# EAGLE board uOsc_2 board_2_v2.0 (EAGLE 9.2.1)
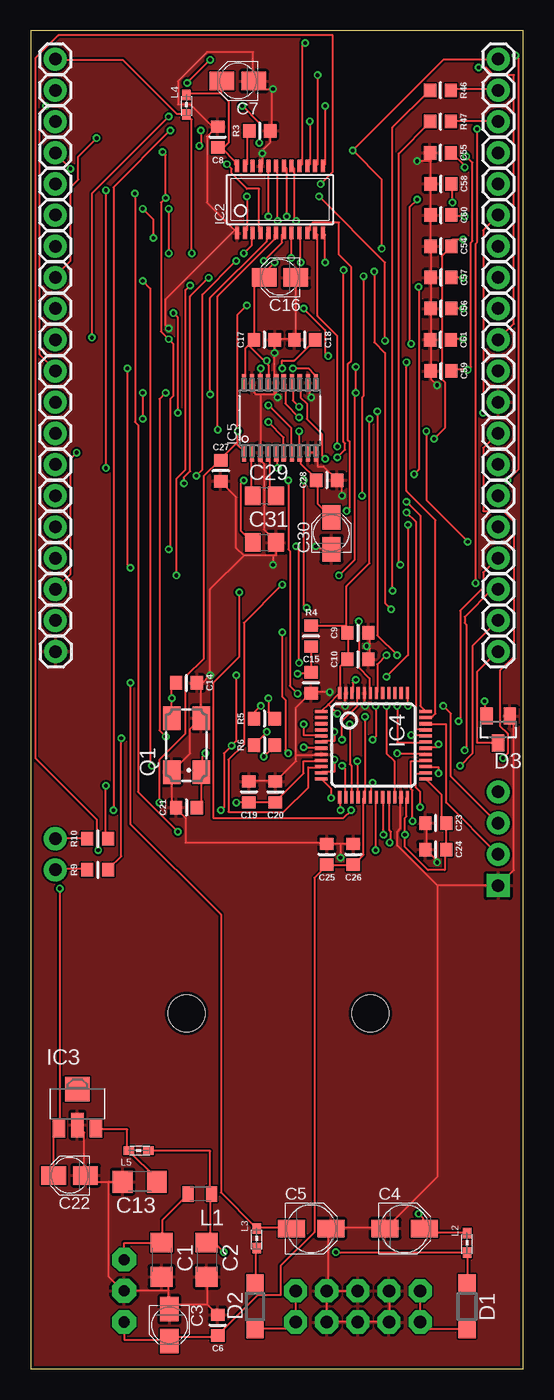
[diagram p5: board, top side]
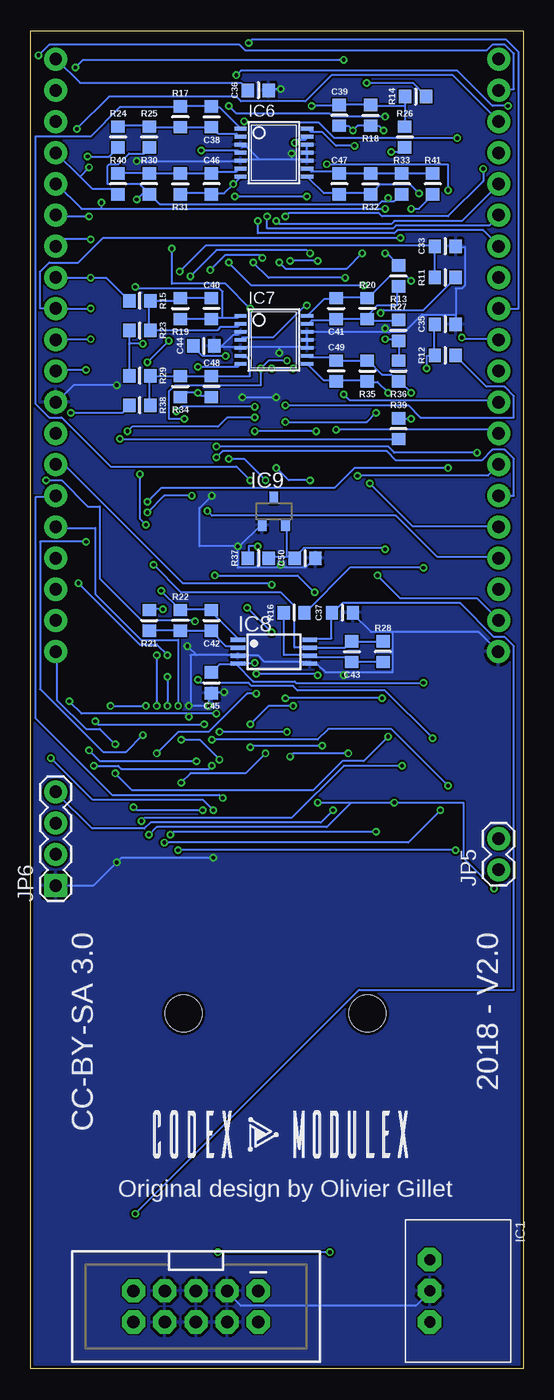
[diagram p6: board, bottom side, seen from below]

Size 40.14 x 109 mm. Coordinates in mm from the lower left corner, seen from the top.
Outline: 0,0 40.14,0 40.14,109 0,109 0,0
Copper layers (1*16): Top 0.035mm / dielectric 1.5mm / Bottom 0.035mm
Design rules "dirt_cheap_dirty_boards.v1.1": minimum track width 6mil, minimum drill 12mil, track to track 6mil, track to pad 6mil, pad to pad 6mil, via to via 6mil, smd to smd 0mil, copper to edge 10mil, drill to drill 10mil, minimum pad ring 10mil, minimum via ring 6mil, stop-mask expansion 2mil, vias tented up to drill 25mil, thermal gap 10mil
Holes 3 mm at 12.7,28.96 27.69,28.96

## Footprints (pad centres in the part's own frame; a part is rotated, then mirrored left to right if it is on the bottom)
PARTS_AMAN_1X01 = drill 1.016 pad 1.88: 1 0,0
C1206 = smd 1.6 x 1.8: 1 -1.4,0; 2 1.4,0
PANASONIC_A = smd 2 x 1.5: + 1.3,0; - -1.3,0
PANASONIC_B = smd 2.2 x 1.4: + 1.6,0; - -1.6,0
PARTS_AMAN_RESISTOR_0603 = smd 1 x 1.1: 1 -0.85,0; 2 0.85,0
C0805 = smd 1.3 x 1.5: 1 -0.95,0; 2 0.95,0
SOD123 = smd 1.4 x 1.4: A 1.9,0; C -1.9,0
SOT23 = smd 1 x 1.4: 1 -0.95,-1.1; 2 0.95,-1.1; 3 0,1.1
WE78 = drill 0.9 pad 1.93 octagon: 1 -2.54,0; 2 0,0; 3 2.54,0
TSSOP24_0635 = smd 0.33 x 1: 1 -3.493,-2.725; 2 -2.857,-2.725; 3 -2.223,-2.725; 4 -1.587,-2.725; 5 -0.953,-2.725; 6 -0.318,-2.725; 7 0.318,-2.725; 8 0.953,-2.725; 9 1.587,-2.725; 10 2.223,-2.725; 11 2.857,-2.725; 12 3.493,-2.725; 13 3.493,2.725; 14 2.857,2.725; 15 2.223,2.725; 16 1.587,2.725; 17 0.953,2.725; 18 0.318,2.725; 19 -0.318,2.725; 20 -0.953,2.725; 21 -1.587,2.725; 22 -2.223,2.725; 23 -2.857,2.725; 24 -3.493,2.725
SOT89 = smd 1 x 1.5: 1 -1.499,-1.981; 3 1.499,-1.981 | smd 1 x 2: 2 0,-1.727 | smd 2 x 2: 2@1 0,1.194
LQFP48 = smd 0.254 x 1: 1 -2.75,-4.25; 2 -2.25,-4.25; 3 -1.75,-4.25; 4 -1.25,-4.25; 5 -0.75,-4.25; 6 -0.25,-4.25; 7 0.25,-4.25; 8 0.75,-4.25; 9 1.25,-4.25; 10 1.75,-4.25; 11 2.25,-4.25; 12 2.75,-4.25; 25 2.75,4.25; 26 2.25,4.25; 27 1.75,4.25; 28 1.25,4.25; 29 0.75,4.25; 30 0.25,4.25; 31 -0.25,4.25; 32 -0.75,4.25; 33 -1.25,4.25; 34 -1.75,4.25; 35 -2.25,4.25; 36 -2.75,4.25 | smd 1 x 0.254: 13 4.25,-2.75; 14 4.25,-2.25; 15 4.25,-1.75; 16 4.25,-1.25; 17 4.25,-0.75; 18 4.25,-0.25; 19 4.25,0.25; 20 4.25,0.75; 21 4.25,1.25; 22 4.25,1.75; 23 4.25,2.25; 24 4.25,2.75; 37 -4.25,2.75; 38 -4.25,2.25; 39 -4.25,1.75; 40 -4.25,1.25; 41 -4.25,0.75; 42 -4.25,0.25; 43 -4.25,-0.25; 44 -4.25,-0.75; 45 -4.25,-1.25; 46 -4.25,-1.75; 47 -4.25,-2.25; 48 -4.25,-2.75
SSOP20 = smd 1.422 x 0.356: 1 -2.845,2.936; 2 -2.845,2.276; 3 -2.845,1.615; 4 -2.845,0.98; 5 -2.845,0.32; 6 -2.845,-0.315; 7 -2.845,-0.98; 8 -2.845,-1.615; 9 -2.845,-2.276; 10 -2.845,-2.936; 11 2.845,-2.936; 12 2.845,-2.276; 13 2.845,-1.615; 14 2.845,-0.98; 15 2.845,-0.315; 16 2.845,0.32; 17 2.845,0.98; 18 2.845,1.615; 19 2.845,2.276; 20 2.845,2.936
TSSOP14_065 = smd 0.305 x 0.991: 1 -1.95,-2.718; 2 -1.3,-2.718; 3 -0.65,-2.718; 4 0,-2.718; 5 0.65,-2.718; 6 1.3,-2.718; 7 1.95,-2.718; 8 1.95,2.718; 9 1.3,2.718; 10 0.65,2.718; 11 0,2.718; 12 -0.65,2.718; 13 -1.3,2.718; 14 -1.95,2.718
TSSOP08 = smd 0.35 x 1.2: 1 -0.975,-2.925; 2 -0.325,-2.925; 3 0.325,-2.925; 4 0.975,-2.925; 5 0.975,2.925; 6 0.325,2.925; 7 -0.325,2.925; 8 -0.975,2.925
DBZ_R-PDSO-G3 = smd 0.7 x 1: 1 -0.95,-1.1; 2 0.95,-1.1; 3 0,1.1
1X02 = drill 1.016 pad 1.88: 1 0,0; 2 2.54,0
1X04 = drill 1.016 pad 1.88 square: 1 0,0 | drill 1.016 pad 1.88: 2 2.54,0; 3 5.08,0; 4 7.62,0
2X5-SHROUDED = drill 1.016 pad 1.88 octagon: 1 -1.27,5.08; 2 1.27,5.08; 3 -1.27,2.54; 4 1.27,2.54; 5 -1.27,0; 6 1.27,0; 7 -1.27,-2.54; 8 1.27,-2.54; 9 -1.27,-5.08; 10 1.27,-5.08
L2012C = smd 0.9 x 1.25: 1 -0.9,0; 2 1,0
0603 = smd 0.85 x 0.7: 1 -0.9,0; 2 0.7,0
CTS406 = smd 1.9 x 1.4: 1 -2.2,-1.2; 2 2.2,-1.2; 3 2.2,1.2; 4 -2.2,1.2

## Placement (x,y rotation side)
3V3  [PARTS_AMAN_1X01]  2,106.68 0 top
+3V3_A  [PARTS_AMAN_1X01]  38.1,106.68 0 top
C1  22u  [C1206]  10.67,8.89 270 top
C2  22u  [C1206]  14.35,8.89 270 top
C3  10u  [PANASONIC_A]  11.3,3.56 270 top
C4  22u  [PANASONIC_B]  30.48,11.43 0 top
C5  22u  [PANASONIC_B]  22.86,11.43 0 top
C6  100n  [PARTS_AMAN_RESISTOR_0603]  15.24,3.56 90 top
C7  10u  [PANASONIC_A]  16.89,104.9 180 top
C8  100n  [PARTS_AMAN_RESISTOR_0603]  15.24,100.33 90 top
C9  1u  [PARTS_AMAN_RESISTOR_0603]  26.67,59.94 0 top
C10  100n  [PARTS_AMAN_RESISTOR_0603]  26.67,57.78 0 top
C13  22u  [C1206]  8.89,15.24 180 top
C14  20p  [PARTS_AMAN_RESISTOR_0603]  12.7,55.88 180 top
C15  100n  [PARTS_AMAN_RESISTOR_0603]  22.86,55.88 270 top
C16  10u  [PANASONIC_A]  20.32,88.9 180 top
C17  100n  [PARTS_AMAN_RESISTOR_0603]  19.05,83.82 0 top
C18  100n  [PARTS_AMAN_RESISTOR_0603]  22.35,83.82 180 top
C19  1u  [PARTS_AMAN_RESISTOR_0603]  17.78,46.99 90 top
C20  100n  [PARTS_AMAN_RESISTOR_0603]  19.94,46.99 90 top
C21  20p  [PARTS_AMAN_RESISTOR_0603]  12.7,45.72 0 top
C22  10u  [PANASONIC_A]  3.17,15.75 180 top
C23  100n  [PARTS_AMAN_RESISTOR_0603]  33.02,44.45 180 top
C24  1u  [PARTS_AMAN_RESISTOR_0603]  33.02,42.29 180 top
C25  1u  [PARTS_AMAN_RESISTOR_0603]  24.13,41.91 90 top
C26  100n  [PARTS_AMAN_RESISTOR_0603]  26.29,41.91 90 top
C27  100n  [PARTS_AMAN_RESISTOR_0603]  15.49,73.15 270 top
C28  100n  [PARTS_AMAN_RESISTOR_0603]  24.13,72.39 0 top
C29  2.2u  [C0805]  19.05,71.12 0 top
C30  10u  [PANASONIC_A]  24.51,68.07 90 top
C31  2.2u  [C0805]  19.05,67.31 0 top
C33  1.0n  [PARTS_AMAN_RESISTOR_0603]  6.35,91.44 0 bottom
C35  1.0n  [PARTS_AMAN_RESISTOR_0603]  6.35,85.09 0 bottom
C36  100n  [PARTS_AMAN_RESISTOR_0603]  21.59,104.14 0 bottom
C37  100n  [PARTS_AMAN_RESISTOR_0603]  14.73,61.59 0 bottom
C38  100p  [PARTS_AMAN_RESISTOR_0603]  25.4,101.98 90 bottom
C39  1.0n  [PARTS_AMAN_RESISTOR_0603]  14.99,102.11 270 bottom
C40  1.0n  [PARTS_AMAN_RESISTOR_0603]  25.4,86.36 270 bottom
C41  1.0n  [PARTS_AMAN_RESISTOR_0603]  15.24,86.36 90 bottom
C42  100p  [PARTS_AMAN_RESISTOR_0603]  25.4,60.96 90 bottom
C43  100p  [PARTS_AMAN_RESISTOR_0603]  13.97,58.42 90 bottom
C44  100n  [PARTS_AMAN_RESISTOR_0603]  26.04,83.31 0 bottom
C45  100n  [PARTS_AMAN_RESISTOR_0603]  25.4,55.88 90 bottom
C46  100p  [PARTS_AMAN_RESISTOR_0603]  25.4,96.52 270 bottom
C47  1.0n  [PARTS_AMAN_RESISTOR_0603]  14.99,96.52 270 bottom
C48  1.0n  [PARTS_AMAN_RESISTOR_0603]  25.4,80.01 270 bottom
C49  1.0n  [PARTS_AMAN_RESISTOR_0603]  15.24,81.28 270 bottom
C50  1u  [PARTS_AMAN_RESISTOR_0603]  17.78,66.04 0 bottom
C54  ESD  [PARTS_AMAN_RESISTOR_0603]  33.44,91.44 180 top
C55  ESD  [PARTS_AMAN_RESISTOR_0603]  33.4,99.06 180 top
C56  ESD  [PARTS_AMAN_RESISTOR_0603]  33.44,86.36 180 top
C57  ESD  [PARTS_AMAN_RESISTOR_0603]  33.44,88.9 180 top
C58  ESD  [PARTS_AMAN_RESISTOR_0603]  33.44,96.52 180 top
C59  ESD  [PARTS_AMAN_RESISTOR_0603]  33.44,81.28 180 top
C60  ESD  [PARTS_AMAN_RESISTOR_0603]  33.44,93.98 180 top
C61  ESD  [PARTS_AMAN_RESISTOR_0603]  33.4,83.82 180 top
D1  1N5819HW  [SOD123]  35.56,5.08 270 top
D2  1N5819HW  [SOD123]  18.29,5.08 90 top
D3  BAT54S  [SOT23]  38.1,52.07 180 top
FREQ_ATT  [PARTS_AMAN_1X01]  38.1,66.04 0 top
FREQ_POT  [PARTS_AMAN_1X01]  38.1,73.66 0 top
GND_1  GND_1  [PARTS_AMAN_1X01]  2.03,58.42 0 top
GND_2  GND_2  [PARTS_AMAN_1X01]  38.1,78.74 0 top
HARMONICS_POT  [PARTS_AMAN_1X01]  38.1,71.12 0 top
IC1  R-78E3.3-0.5  [WE78]  7.62,6.35 270 bottom
IC2  TLC59281DBQ  [TSSOP24_0635]  20.32,95.25 0 top
IC3  LD2981ABU33  [SOT89]  3.81,21.59 0 top
IC4  STM32F373CCT6  [LQFP48]  27.94,50.8 270 top
IC5  PCM5100APW  [SSOP20]  20.32,77.47 90 top
IC6  MCP6004  [TSSOP14_065]  20.32,99.06 270 bottom
IC7  MCP6004  [TSSOP14_065]  20.32,83.82 270 bottom
IC8  TL072PW  [TSSOP08]  20.32,58.42 270 bottom
IC9  LM4040B10  [DBZ_R-PDSO-G3]  20.32,69.85 0 bottom
JP5  [1X02]  2,40.64 90 bottom
JP6  [1X04]  38.1,39.37 90 bottom
JP8  M05X2SHD  [2X5-SHROUDED]  26.67,5.08 270 bottom
L1  33u  [L2012C]  13.84,14.22 180 top
L2  [0603]  35.56,10.16 270 top
L3  [0603]  18.41,10.54 270 top
L4  [0603]  12.7,102.87 270 top
L5  [0603]  8.89,17.78 0 top
LED1_G  [PARTS_AMAN_1X01]  2,99.06 0 top
LED1_R  [PARTS_AMAN_1X01]  2,96.52 0 top
LED2_G  [PARTS_AMAN_1X01]  2,93.98 0 top
LED2_R  [PARTS_AMAN_1X01]  2,91.44 0 top
LED3_G  [PARTS_AMAN_1X01]  2,86.36 0 top
LED3_R  [PARTS_AMAN_1X01]  2,88.9 0 top
LED4_G  [PARTS_AMAN_1X01]  2,81.28 0 top
LED4_R  [PARTS_AMAN_1X01]  2,83.82 0 top
LED5_G  [PARTS_AMAN_1X01]  2,76.2 0 top
LED5_R  [PARTS_AMAN_1X01]  2,78.74 0 top
LED6_G  [PARTS_AMAN_1X01]  2,71.12 0 top
LED6_R  [PARTS_AMAN_1X01]  2,73.66 0 top
LED7_G  [PARTS_AMAN_1X01]  2,66.04 0 top
LED7_R  [PARTS_AMAN_1X01]  2,68.58 0 top
LED8_G  [PARTS_AMAN_1X01]  2,60.96 0 top
LED8_R  [PARTS_AMAN_1X01]  2,63.5 0 top
MORPH_ATT  [PARTS_AMAN_1X01]  38.1,60.96 0 top
MORPH_POT  [PARTS_AMAN_1X01]  38.1,68.58 0 top
Q1  8MHz  [CTS406]  12.7,50.8 90 top
R3  10k  [PARTS_AMAN_RESISTOR_0603]  18.67,100.84 0 top
R4  10k  [PARTS_AMAN_RESISTOR_0603]  22.86,59.69 270 top
R5  100  [PARTS_AMAN_RESISTOR_0603]  19.05,52.96 0 top
R6  100  [PARTS_AMAN_RESISTOR_0603]  19.05,50.8 0 top
R9  100  [PARTS_AMAN_RESISTOR_0603]  5.46,40.64 0 top
R10  100  [PARTS_AMAN_RESISTOR_0603]  5.46,43.18 0 top
R11  2.2k  [PARTS_AMAN_RESISTOR_0603]  6.35,88.9 0 bottom
R12  2.2k  [PARTS_AMAN_RESISTOR_0603]  6.35,82.55 0 bottom
R13  100k  [PARTS_AMAN_RESISTOR_0603]  10.16,89.03 90 bottom
R14  100k  [PARTS_AMAN_RESISTOR_0603]  8.76,103.63 0 bottom
R15  100k  [PARTS_AMAN_RESISTOR_0603]  31.24,87 180 bottom
R16  10k  [PARTS_AMAN_RESISTOR_0603]  18.67,61.59 0 bottom
R17  56k  [PARTS_AMAN_RESISTOR_0603]  27.94,101.98 270 bottom
R18  33k  [PARTS_AMAN_RESISTOR_0603]  12.45,102.11 90 bottom
R19  20k  [PARTS_AMAN_RESISTOR_0603]  27.94,86.36 90 bottom
R20  33k  [PARTS_AMAN_RESISTOR_0603]  12.7,86.36 270 bottom
R21  10k  [PARTS_AMAN_RESISTOR_0603]  30.48,60.96 90 bottom
R22  33k  [PARTS_AMAN_RESISTOR_0603]  27.94,60.96 270 bottom
R23  120k  [PARTS_AMAN_RESISTOR_0603]  31.24,84.58 180 bottom
R24  100k  [PARTS_AMAN_RESISTOR_0603]  33.02,100.33 270 bottom
R25  200k  [PARTS_AMAN_RESISTOR_0603]  30.48,100.33 270 bottom
R26  110k  [PARTS_AMAN_RESISTOR_0603]  9.65,100.33 270 bottom
R27  200k  [PARTS_AMAN_RESISTOR_0603]  10.16,84.58 270 bottom
R28  33k  [PARTS_AMAN_RESISTOR_0603]  11.43,58.42 270 bottom
R29  140k  [PARTS_AMAN_RESISTOR_0603]  31.24,80.9 180 bottom
R30  200k  [PARTS_AMAN_RESISTOR_0603]  30.48,96.52 270 bottom
R31  33k  [PARTS_AMAN_RESISTOR_0603]  27.94,96.52 90 bottom
R32  20k  [PARTS_AMAN_RESISTOR_0603]  12.45,96.52 90 bottom
R33  120k  [PARTS_AMAN_RESISTOR_0603]  9.91,96.52 270 bottom
R34  33k  [PARTS_AMAN_RESISTOR_0603]  27.94,80.01 90 bottom
R35  20k  [PARTS_AMAN_RESISTOR_0603]  12.7,81.28 90 bottom
R36  120k  [PARTS_AMAN_RESISTOR_0603]  10.16,81.28 90 bottom
R37  2.2k  [PARTS_AMAN_RESISTOR_0603]  21.59,66.04 0 bottom
R38  100k  [PARTS_AMAN_RESISTOR_0603]  31.24,78.49 180 bottom
R39  100k  [PARTS_AMAN_RESISTOR_0603]  10.16,76.58 270 bottom
R40  100k  [PARTS_AMAN_RESISTOR_0603]  33.02,96.52 270 bottom
R41  100k  [PARTS_AMAN_RESISTOR_0603]  7.37,96.52 270 bottom
R46  1.0k  [PARTS_AMAN_RESISTOR_0603]  33.4,104.14 180 top
R47  1.0k  [PARTS_AMAN_RESISTOR_0603]  33.4,101.6 180 top
SW1  [PARTS_AMAN_1X01]  2,104.14 0 top
SW2  [PARTS_AMAN_1X01]  2,101.6 0 top
TIMBRE_ATT  [PARTS_AMAN_1X01]  38.1,63.5 0 top
TIMBRE_POT  [PARTS_AMAN_1X01]  38.1,76.2 0 top
TO_BAT  [PARTS_AMAN_1X01]  38.1,58.42 0 top
TO_IC6A  [PARTS_AMAN_1X01]  38.1,81.28 0 top
TO_IC6B  [PARTS_AMAN_1X01]  38.1,99.06 0 top
TO_IC6C  [PARTS_AMAN_1X01]  38.1,86.36 0 top
TO_IC6D  [PARTS_AMAN_1X01]  38.1,83.82 0 top
TO_IC7A  [PARTS_AMAN_1X01]  38.1,88.9 0 top
TO_IC7B  [PARTS_AMAN_1X01]  38.1,93.98 0 top
TO_IC7C  [PARTS_AMAN_1X01]  38.1,91.44 0 top
TO_IC7D  [PARTS_AMAN_1X01]  38.1,96.52 0 top
TO_IC8A  [PARTS_AMAN_1X01]  38.1,104.14 0 top
TO_IC8B  [PARTS_AMAN_1X01]  38.1,101.6 0 top
U$1  [GMSN_LMNC_LOGO]  21.59,19.05 0 bottom

## Tracks (layer width: path | path; a pad name or v marks a point on that pad's centre or on a via)
+3V3  (via drill 0.3)
  Top 0.152: 3V3.1 2,106.62 7.5,106.62 11.88,102.25 12.62,102.25 L4.2 12.75,102.12 13.12,101.75 v13.12,90.88 | 17.75,83.38 17.5,83.12 17.5,80.38 IC5.20 | 17.75,83.38 18.12,83.75 C17.1 | 17.75,83.38 19.12,82 | 19.12,82 19.38,81.75 19.38,80.38 IC5.17 | 17.75,83.38 C17.1 | v21.38,81.5 22.62,81.5 23.12,81 23.12,80.5 23.25,80.38 IC5.11 | 19.12,82 v19.25,82.12 | C17.1 18.25,83.88 18.25,88.12 19,88.88 C16.+ 19.12,89 19.12,89.38 v19.88,90.12 | IC1.3 7.62,3.75 7.62,2.38 11.25,2.38 C3.+ 11.38,2.38 11.38,2.62 15.12,2.62 C6.1 15.25,2.75 18.5,6 20.38,6 20.38,8.38 23.12,11.12 23.12,40 24.12,41 C25.1 24.25,41 26.25,41 C26.1 26.38,41.12 27.12,41.88 27.12,46.5 IC4.17 27.25,46.62 v27.25,53.12 | 25.75,60.5 22.88,60.5 R4.1 | 25.75,60.5 25.75,60 C9.1 25.88,59.88 25.88,57.88 C10.1 25.75,57.75 25.25,57.25 25.25,55.12 IC4.48 25.12,55 24.25,54.12 | 24.25,54.12 23.75,53.62 IC4.1 | v37,54.38 37,53.38 37.12,53.25 D3.2 | 24.25,54.12 v25,53.38 | v27.62,77.38 27.62,65.62 25.75,63.75 25.75,60.5
  Bottom 0.152: v19.25,82.12 20.75,82.12 v21.38,81.5 21.38,80.12 28.38,80.12 28.88,79.62 28.88,77.38 v27.62,77.38 | v37,54.38 36,53.38 27.25,53.38 | v25,53.38 27.25,53.38 | 27.25,53.38 v27.25,53.12 | v13.12,90.88 14.38,89.62 19.38,89.62 v19.88,90.12
+3V3_A  (via drill 0.3)
  Top 0.152: +3V3_A.1 38,106.62 33.62,106.62 v26.25,99.25 28.62,96.88 v28.62,91.25 | C30.+ 23.38,70.5 23.38,72.38 C28.1 23.25,72.5 22,73.75 22,74.62 IC5.8 21.88,74.75 v21.88,76.38 | v17.62,86.62 16.88,85.88 v16.88,76.38 16.88,75.5 | 16.88,75.5 16.88,75.25 17.38,74.75 IC5.1 | 16.88,75.5 15.5,74.12 C27.1 15.38,74 14.12,72.75 14.12,57.88 12.62,56.38 12.62,51.75 10.5,49.62 v10.5,46.12 | v24.25,82.5 24,82.75 24,84.62 v22.25,86.38 | IC4.25 32.25,48 33.5,46.75 33.5,44.75 33.75,44.5 C23.1 33.88,44.38 33.88,42.38 C24.1 33.75,42.25 33.75,40.62 32.38,40.62 30.5,42.5 v30.5,43.5 30.5,44.88 30.62,45 30.62,46.5 IC4.24 | C22.+ 1.88,19.12 2.25,19.5 IC3.1 2.38,19.62 v2.38,39.12 | IC4.9 23.62,49.5 22.25,49.5 22.25,48.5 20,46.25 C20.1 19.88,46.12 17.88,46.12 C19.1 17.75,46.12 v16.75,46.12
  Bottom 0.152: v26.25,99.25 23.25,99.25 23.12,99.12 IC6.4 | C36.1 22.5,104.25 23,104.75 36.12,104.75 38,106.62 +3V3_A.1 | 22.25,84 20.38,84 17.75,86.62 v17.62,86.62 | 22.25,84 22.88,84 23,83.88 IC7.4 | v24.25,82.5 26.12,82.5 26.88,83.25 C44.1 | 22.25,84 v22.25,86.38 24.25,88.38 28.62,88.38 v28.62,91.25 | v16.88,76.38 v21.88,76.38 | v2.38,39.12 4.88,41.62 4.88,46.12 v10.5,46.12 14,46.12 | v16.75,46.12 14,46.12 | v30.5,43.5 29.88,44.12 16,44.12 14,46.12
ADC_FM  (via drill 0.3)
  Top 0.152: v29,54 29,50.12 29.62,49.5 29.62,46.62 IC4.22 | v29,56.38 30.75,58.12 v30.75,68.75 | v31.25,72.88 31.62,73.25 v31.62,88.12
  Bottom 0.152: 24.5,85.62 25.38,85.62 C40.2 25.5,85.5 27.88,85.5 R19.1 | 24.5,85.62 23.25,85.62 23.12,85.75 IC7.1 | v29,56.38 v29,54 | v30.75,68.75 31.25,69.25 v31.25,72.88 | v31.62,88.12 31.5,88 24.75,88 24.5,87.75 24.5,85.62
ADC_GATE  (via drill 0.3)
  Top 0.152: v13.75,99.62 13.88,99.75 v13.88,100.88 | v29.25,42.88 29.38,43 29.38,43.75 29.25,43.88 29.25,46.5 IC4.21 | v6.75,45.5 6.75,96.25 v11.38,100.88
  Bottom 0.152: v13.75,99.62 15.25,99.62 16.38,100.75 17.25,100.75 17.5,101 IC6.14 | C39.2 14.88,101.25 14.25,101.25 v13.88,100.88 13.5,101.25 12.5,101.25 R18.1 12.38,101.25 11.75,101.25 v11.38,100.88 | v29.25,42.88 9.38,42.88 v6.75,45.5
ADC_HARMONICS  (via drill 0.3)
  Top 0.152: v31.12,44.62 31.12,47.12 31,47.25 31,49.5 32.12,49.5 IC4.28 | v9.88,49.12 9.75,49.25 9.75,88 v9.12,88.62
  Bottom 0.152: IC7.14 17.5,85.88 16.25,87.12 15.25,87.12 C41.2 15.12,87.25 12.75,87.25 R20.1 12.62,87.25 10.88,89 9.5,89 v9.12,88.62 | v31.12,44.62 30.88,44.88 18.88,44.88 14.62,49.12 v9.88,49.12
ADC_MODEL  (via drill 0.3)
  Top 0.152: v28.12,42.25 28.12,46.5 IC4.19 | v5.5,42.25 5.38,42.38 5.38,44.75 0.38,49.75 0.38,106.75 2.25,108.62 24.62,108.62 24.62,97.5 v23.62,96.5
  Bottom 0.152: IC6.7 23.12,97 v23.62,96.5 24.38,95.75 25.38,95.75 C46.2 25.5,95.75 27.88,95.75 R31.1 | v5.5,42.25 v28.12,42.25
ADC_MORPH  (via drill 0.3)
  Top 0.152: v33.25,48.5 33.25,49 32.25,49 IC4.27 | v11,51.5 10.5,52 10.5,79 v11,79.5
  Bottom 0.152: IC7.8 17.5,81.75 16.25,80.5 15.25,80.5 C49.2 15.12,80.5 12.75,80.5 R35.1 12.62,80.38 11.88,80.38 v11,79.5 | v33.25,48.5 31.88,47.12 17.12,47.12 14.75,49.5 13,49.5 v11,51.5
ADC_TIMBRE  (via drill 0.3)
  Top 0.152: v28.75,43.5 28.75,46.5 IC4.20 | v12,43.75 8.75,47 8.75,76.88 8.5,77.12 v8.5,95.75
  Bottom 0.152: IC6.8 17.5,97 16.25,95.75 15,95.75 C47.2 14.88,95.75 12.5,95.75 R32.1 12.38,95.75 11.62,96.5 9.25,96.5 v8.5,95.75 | v28.75,43.5 28.5,43.75 v12,43.75
ADC_TRIG  (via drill 0.3)
  Top 0.152: v27.88,47.75 27.75,47.62 27.75,46.62 IC4.18 | v21,50.12 20.75,50.38 20.75,54.5 20.5,54.75 v20.5,60 | v22.5,62 22.25,62.25 v22.25,72.38
  Bottom 0.152: IC6.1 23.12,101.12 24.75,102.75 25.38,102.75 C38.2 25.5,102.88 27.88,102.88 R17.1 28,102.75 32.88,102.75 35.25,100.38 39.75,100.38 39.75,78.62 38.62,77.5 37.62,77.5 33.62,73.5 23.38,73.5 v22.25,72.38 | v27.88,47.75 27.12,48.5 22.62,48.5 v21,50.12 | v22.5,62 v20.5,60
ADC_V_OCT  (via drill 0.3)
  Top 0.152: v26.5,81.62 v26.5,79.5 26.38,79.38 26.38,65.88 v25.12,64.62 | v31.75,45.75 31.75,47 31.38,47.38 31.38,48.5 32.12,48.5 IC4.26 | v26.12,45.5 25.5,44.88 14.88,44.88 14.88,55.88 17,58 v17,63.25
  Bottom 0.152: v26.5,81.62 23.25,81.62 23.12,81.75 IC7.7 | C48.2 25.5,79.25 26.25,79.25 v26.5,79.5 27.62,79.5 27.88,79.25 R34.1 | v31.75,45.75 31.5,45.5 v26.12,45.5 | v17,63.25 18.38,64.62 v25.12,64.62
AREF_-10  (via drill 0.3)
  Top 0.152: v10.75,99.12 11,98.88 v11,95.38 10.62,95 10.62,84.5 v11.25,83.88 11.62,83.5 11.62,79.25 11.38,79 11.38,66.88 v11.25,66.75 | v31,83.5 30.88,83.62 30.88,94.62 v31.5,95.25
  Bottom 0.152: 19.25,66.12 19.25,68.75 IC9.2 | 19.25,66.12 18.75,66.12 C50.1 18.62,66.12 17.88,66.88 11.38,66.88 v11.25,66.75 | 19.25,66.12 20.62,66.12 R37.2 | 32.12,83.5 32.12,84.5 R23.2 | 32.12,83.5 32.12,81 R29.2 | R36.2 10.12,82.25 10.12,83.62 R27.2 10.25,83.75 10.38,83.88 v11.25,83.88 | 11,95.12 11.5,95.12 11.75,94.88 29.62,94.88 30.38,95.62 R30.2 | 11,95.12 10.5,95.12 10,95.62 R33.2 | v10.75,99.12 10,99.12 9.75,99.38 R26.2 | 11,95.12 v11,95.38 | 30.75,96 30.5,95.75 R30.2 | 30.75,96 31.25,96.5 33.88,96.5 33.88,98 33.75,98.12 33,98.12 32.12,99 30.88,99 30.5,99.38 R25.2 | v31,83.5 32.12,83.5 | 30.75,96 v31.5,95.25 | 30.75,96 R30.2
DAC_BCK  (via drill 0.3)
  Top 0.152: v29.88,50.12 32.12,50.12 IC4.29 | v21.75,55 21.12,55.62 21.12,66.62 21,66.75 v21,72.38 | v24,74.12 23.75,74.38 23.75,76.12 22.5,77.38 22.5,78.62 22,79.12 22,80.25 IC5.13
  Bottom 0.152: v29.88,50.12 28.12,51.88 25.62,51.88 22.5,55 v21.75,55 | v21,72.38 22.75,74.12 v24,74.12
DAC_DIN  (via drill 0.3)
  Top 0.152: v29.88,54 29.88,51 32.12,51 IC4.31 | v29.88,58.12 28.25,59.75 v28.25,78 | v21.88,78.38 21.38,78.88 21.38,80.25 IC5.14
  Bottom 0.152: v29.88,58.12 v29.88,54 | v28.25,78 27.88,78.38 v21.88,78.38
DAC_LRCK  (via drill 0.3)
  Top 0.152: v31,51.62 32.12,51.62 IC4.32 | v35.62,67.38 32.25,70.75 v32.25,76.38 | v21.88,77.5 20.75,78.62 20.75,80.25 IC5.15
  Bottom 0.152: v31,51.62 32.38,50.25 34.25,50.25 39.38,55.38 39.38,67.38 v35.62,67.38 | v32.25,76.38 31.88,76.75 24.88,76.75 24.12,77.5 v21.88,77.5
FM_IN  (via drill 0.3)
  Top 0.152: v35.25,88.88 34.38,88.88 C57.1
  Bottom 0.152: R15.2 32.12,87 34,88.88 v35.25,88.88 38,88.88 TO_IC7A.1
FREQ_ATT  (via drill 0.3)
  Top 0.152: v26,52.5 26,49.25 26.12,49.12 26.12,46.62 IC4.15 | v34.88,52.75 35,52.88 35,61.75 36.88,63.62 36.88,64.88 38,66 FREQ_ATT.1
  Bottom 0.152: v26,52.5 34.62,52.5 v34.88,52.75
FREQ_POT  (via drill 0.3)
  Top 0.152: v20.5,63.88 17.38,60.75 17.38,50.88 16.12,49.62 16.12,45.38 20.62,45.38 22.62,47.38 22.62,49 23.62,49 IC4.10
  Bottom 0.152: v20.5,63.88 20.62,64 27.75,64 37.38,73.62 38,73.62 FREQ_POT.1
GATE_IN  (via drill 0.3)
  Top 0.152: v14.62,106.62 v12.75,104.75 | v36.5,106 37.12,106 37.75,105.38 39.38,105.38 39.38,85.12 38.12,83.88 TO_IC6D.1 | v35.25,83.88 34.38,83.88 C61.1
  Bottom 0.152: v12.75,104.75 9,104.75 8,103.75 R14.2 | v14.62,106.62 35.88,106.62 v36.5,106 | v35.25,83.88 38,83.88 TO_IC6D.1
GATE_IN1  (via drill 0.3)
  Top 0.152: C59.1 34.38,81.38 v35.62,81.38 35.88,81.62 35.88,91.75 36,91.88 36,98.25 v35.5,98.75
  Bottom 0.152: v35.62,81.38 38,81.38 TO_IC6A.1 | v35.5,98.75 33.75,98.75 33.12,99.38 R24.2
GND  (via drill 0.3)
  Top 0.152: 16.62,92.75 14.38,95 14.38,100.38 15,101 | 16.62,92.75 16.75,92.62 IC2.1 | 15,101 15.12,101.12 C8.2 15,101 | IC2.21 18.75,98 18.88,98.12 v18.88,99 18.88,99.25 19.5,99.88 19.5,100.75 R3.2 19.62,100.88 19.62,104.25 | 19.62,104.25 18.25,104.25 18.25,104.88 C7.- 18.12,105 18.12,107.25 14.38,107.25 12,104.88 12,103 13,103 15,101 | 19.62,104.25 v19.75,104.25 19.62,104.25 | 32.62,98.38 32.62,96.62 C58.2 32.62,96.5 32.62,94 C60.2 32.62,93.88 32.62,91.5 C54.2 32.62,91.38 32.62,89 C57.2 32.62,88.88 32.62,86.38 C56.2 32.62,86.25 32.62,83.88 C61.2 32.62,83.75 32.62,81.38 C59.2 32.62,81.25 32.62,80.62 v33.12,80.12 | 32.62,98.38 32.62,99 C55.2 | 32.62,98.38 v31.5,98.38 | JP8.7 29.25,6.25 29.25,3.88 JP8.8 29.12,3.88 26.75,3.88 JP8.6 26.62,3.88 24.25,3.88 JP8.4 24.12,3.88 24.12,6.25 JP8.3 | 24.25,6.38 24.25,11.25 24.38,11.38 C5.+ 24.5,11.5 28.88,11.5 C4.- 29,11.5 33.12,15.62 33.12,39.38 | 24.25,6.38 JP8.3 | 24.25,6.38 26.62,6.38 JP8.5 | 24.25,6.38 JP8.3 | 6.38,15.25 4.5,15.25 4.5,15.62 C22.- 4.38,15.75 4.38,19.25 3.88,19.75 IC3.2 | 6.38,15.25 7.38,15.25 C13.2 | 14.38,5.25 15.12,4.5 C6.2 | 14.38,5.25 14.38,7.38 C2.2 | 11.25,5.25 11.25,4.88 C3.- 11.25,5.25 | 11.25,5.25 11.25,6.38 | 11.25,6.38 11.25,6.88 10.75,7.38 C1.2 | 11.25,5.25 14.38,5.25 | 11.25,6.38 7.62,6.38 IC1.2 7.5,6.38 6.38,7.5 6.38,15.25 | IC5.9 22.62,74.62 IC5.10 23.38,74.62 23.38,73.5 23.88,73.5 24.88,72.5 C28.2 25,72.38 25.38,72 v25.38,71.12 | v23.25,67 23.25,66.88 24.5,66.88 C30.- | 17.38,66.25 16.75,66.88 16.75,71 15.5,72.25 C27.2 | 19.75,66.25 20,66.25 20,67.25 C31.2 20,67.38 19,68.38 19,73.75 18.75,74 18.75,74.62 IC5.3 18.75,74.75 18.75,79.38
  Top 0.152: 19.75,66.25 17.38,66.25 | 20,79.38 19.88,79.38 | 19.88,79.38 18.75,79.38 | 18.75,79.38 18.38,79.38 18.25,79.5 18.25,80.12 18.12,80.25 IC5.19 | 20,79.38 20,80.25 IC5.16 | v22.88,79.12 22.75,79.25 22.75,80.12 22.62,80.25 IC5.12 | v20.12,79.12 20,79.25 20,79.38 | 19.88,79.38 v19.88,82.75 19.88,83.75 C17.2 20,83.88 21.5,83.88 C18.2 21.62,83.88 21.62,88.88 C16.- | 19.75,66.25 v19.75,65.5 | 21.62,50 23.62,50 IC4.8 | 21.62,50 21.62,49.5 20,47.88 C20.2 19.88,47.88 17.88,47.88 C19.2 | 21.62,50 21.62,53.88 22.75,55 C15.2 22.88,55.12 v24.38,55.12 | v25.62,54 25.62,55 IC4.47 | v27.25,54 27.25,55 IC4.44 | 27.62,58.88 27.62,59.88 C9.2 | 27.62,58.88 27.62,57.88 C10.2 | v27.38,58.88 27.62,58.88 | C23.2 32.25,44.38 32.25,42.38 C24.2 32.25,42.25 33.12,41.38 v33.12,41.25 | 33.12,39.38 29.88,42.62 29.88,43.75 30.12,44 30.12,46.5 IC4.23 | 33.12,39.38 38,39.38 JP6.1 38.12,39.38 39.38,40.62 39.38,52.88 39.12,53.12 D3.1 | 13.88,55.62 13.62,55.88 C14.1 13.88,55.62 | 13.88,53 13.88,55.62 | 13.88,53 Q1.2 13.88,53 | 25.25,42.75 26.25,42.75 C26.2 | 25.25,42.75 24.25,42.75 C25.2 24.12,42.88 12.62,42.88 12.62,44.88 11.88,45.62 C21.1 11.75,45.75 11.5,46 11.5,48.5 Q1.4 11.5,48.62 13,50.12 13,52.12 13.88,53 | 25.25,42.75 v25.25,41.62 | 13.88,55.62 13.88,55.75 v14.62,56.5 14.62,63.5 17.38,66.25 | 16.62,92.75 11,87.12 11,85 v11.25,84.75
  Bottom 0.152: 17.62,98.5 17.62,99 IC6.11 17.62,99.12 17.62,99.62 IC6.12 | 17.62,98.5 IC6.10 17.62,98.5 | 17.62,98.5 18.88,98.5 | 18.88,98.5 21.5,98.5 | 21.5,98.5 23,98.5 IC6.5 23.12,98.38 v31.5,98.38 | 21.5,98.5 22.5,99.5 22.88,99.5 23,99.62 IC6.3 | v19.75,104.25 20.62,104.25 C36.2 | v18.88,99 18.88,98.5 | v33.12,80.12 36.62,80.12 38,78.75 GND_2.1 | JP8.3 24.12,6.25 23,5.12 8.75,5.12 7.62,6.25 IC1.2 | 5.5,85.88 5.5,88 5,88 4.75,88.25 4.75,91.38 5.5,91.38 C33.2 | 5.5,85.88 5.5,85.12 C35.2 | 17.62,83.25 17.62,83.75 IC7.11 17.62,83.88 17.62,84.38 IC7.12 17.5,84.5 11.25,84.5 | 17.62,83.25 IC7.10 17.62,83.25 | 24.62,83.25 25.12,83.25 C44.2 | 24.62,83.25 23.12,83.25 IC7.5 23,83.25 19.88,83.25 | 24.62,83.25 23.62,84.25 23.25,84.25 23.12,84.38 IC7.3 | 19.88,83.25 17.62,83.25 | 5.5,85.88 8.25,85.88 9.62,84.5 11.25,84.5 | 23.12,67 23.25,66.88 23.25,65.25 19.75,65.25 | 23.12,67 21.38,68.75 IC9.1 | 19.75,65.25 17.75,65.25 17,66 C50.2 | 23.12,67 v23.25,67 26.38,67 26.38,70.12 v25.38,71.12 | v20.12,79.12 v22.88,79.12 | v19.75,65.5 19.75,65.25 | v19.88,82.75 19.88,83.25 | 10.62,60 3.62,60 2.12,58.5 GND_1.1 | 10.62,60 12.38,60 13.88,61.5 C37.2 | 27.12,54 v25.62,54 25.62,55 25.5,55 C45.1 25.38,55.12 v24.38,55.12 | 27.12,54 v27.25,54 27.12,54 | 26.62,58.12 v27.38,58.88 | 26.62,58.12 23.25,58.12 IC8.3 23.12,58.12 21.62,58.12 21.12,57.62 17.62,57.62 17.5,57.5 IC8.5 17.38,57.38 16.75,57.38 16.12,56.75 14.62,56.75 | 27.12,54 27.12,58.12 26.62,58.12 | 10.62,60 10.62,56.75 14.62,56.75 | JP6.1 38,39.38 35,39.38 v33.12,41.25 32.75,41.62 v25.25,41.62 | v14.62,56.5 14.62,56.75 | 11.25,84.5 v11.25,84.75
  pour Top (isolate 0.012): 0,109.22 40.64,109.22 40.64,0 0,0
  pour Bottom (isolate 0.012): 0,109.22 40.64,109.22 40.64,0 0,0
HARMONICS_IN  (via drill 0.3)
  Top 0.152: v11.25,94.5 v11.25,90.88 | v34.38,95 34.38,96.5 C58.1
  Bottom 0.152: v11.25,90.88 11.12,90.88 10.25,90 R13.2 | 34.38,94.5 36,94.5 38,96.5 TO_IC7D.1 | 34.38,94.5 v11.25,94.5 | 34.38,94.5 v34.38,95
HARMONICS_POT  (via drill 0.3)
  Top 0.152: v24.5,46.5 24.5,47.25 23.75,48 IC4.12
  Bottom 0.152: v24.5,46.5 24.75,46.75 33.5,46.75 39.75,53 39.75,71 38.12,71 HARMONICS_POT.1
LEDS_SCK  (via drill 0.3)
  Top 0.152: v30.62,69.75 31.38,69 31.38,52.12 32.12,52.12 IC4.33 | v27,71.12 27,79.12 27.12,79.25 v27.12,89 | v17.38,90.88 18,91.5 18,92.5 IC2.3
  Bottom 0.152: v30.62,69.75 29.25,71.12 v27,71.12 | v27.12,89 25,91.12 17.62,91.12 v17.38,90.88
LEDS_SIN  (via drill 0.3)
  Top 0.152: v17.62,95.5 17.62,92.75 17.5,92.62 IC2.2 | v23.5,95.5 28.88,90.12 v28.88,83.75 | v30.62,82 30.62,71.5 33,69.12 33,53.38 32.75,53.12 32.25,53.12 IC4.35
  Bottom 0.152: v23.5,95.5 v17.62,95.5 | v30.62,82 v28.88,83.75
LEDS_SS  (via drill 0.3)
  Top 0.152: v30.62,70.62 31.75,69.5 31.75,54 32.12,53.62 IC4.36 | v6.12,96 v6.12,73.38 | v16,98.12 16.38,97.75 16.38,97.38 17.62,96.12 18.62,96.12 18.62,92.62 IC2.4
  Bottom 0.152: v30.62,70.62 29.5,71.75 15.38,71.75 13.75,73.38 v6.12,73.38 | v6.12,96 6.12,98.12 v16,98.12
MODEL_IN  (via drill 0.3)
  Top 0.152: v35.38,97.88 35.38,98 34.38,99 C55.1
  Bottom 0.152: 36.12,97.12 38,99 TO_IC6B.1 | 36.12,97.12 35.12,96.12 33.5,96.12 33.12,95.75 R40.2 | 36.12,97.12 v35.38,97.88
MORPH_ATT  (via drill 0.3)
  Top 0.152: v25.38,49.12 25.62,48.88 25.62,46.62 IC4.14 | v35,49.12 36,50.12 36,58.88 38,60.88 MORPH_ATT.1
  Bottom 0.152: v25.38,49.12 25.62,48.88 32.75,48.88 33,49.12 v35,49.12
MORPH_IN  (via drill 0.3)
  Top 0.152: v32.88,75.75 33.75,76.62 33.75,80.38 33.5,80.62 33.5,90.62 34.25,91.38 C54.1 34.38,91.5 34.38,92 v35.25,92
  Bottom 0.152: v32.88,75.75 10.25,75.75 R39.2 | v35.25,92 37.5,92 38,91.5 TO_IC7C.1
MORPH_POT  (via drill 0.3)
  Top 0.152: v24.75,49.62 24.75,48.62 23.75,48.62 IC4.11 | v27.88,51.25 28.12,51.5 v28.12,54
  Bottom 0.152: v24.75,49.62 26.38,51.25 v27.88,51.25 | v28.12,54 28.12,59.38 31.12,59.38 34.88,63.12 34.88,68.5 38,68.5 MORPH_POT.1
N$1
  Top 0.152: L1.2 12.75,14.12 10.75,12.12 10.75,10.38 C1.1 10.62,10.25 7.62,10.25 7.62,9 IC1.1
N$2  (via drill 0.3)
  Top 0.152: v24,90.12 24,92.38 23.88,92.5 IC2.12 | v13,88.25 12.62,87.88 12.62,73.25 11.88,72.5 v11.88,64.62
  Bottom 0.152: v24,90.12 22.12,88.25 v13,88.25 | v11.88,64.62 10,62.75 3.75,62.75 2,61 LED8_G.1
N$4
  Bottom 0.152: IC6.2 23.12,100.38 23.38,100.62 24.88,100.62 25.38,101.12 C38.1 25.5,101.12 27.88,101.12 R17.2 28,101.12 30.38,101.12 R25.1 30.5,101.25 33,101.25 R24.1
N$5  (via drill 0.3)
  Top 0.152: v25,75.12 25,84.12 23.38,85.75 23.38,92.38 23.25,92.5 IC2.11 | v3.75,74.62 3.25,74.12 3.25,64.75 LED8_R.1
  Bottom 0.152: v25,75.12 11,75.12 10.5,74.62 v3.75,74.62
N$6
  Top 0.152: IC5.2 18,74.62 18,71.12 C29.1
N$7  (via drill 0.3)
  Top 0.152: v22.25,52.5 22.25,51.62 23.62,51.62 IC4.5 | v18.75,54 18.25,53.5 18.25,53 R5.1
  Bottom 0.152: v22.25,52.5 20.75,54 v18.75,54
N$8  (via drill 0.3)
  Top 0.152: v24.75,51.88 24.75,51.12 23.75,51.12 IC4.6 | v19.25,51.88 18.25,50.88 R6.1
  Bottom 0.152: v19.25,51.88 v24.75,51.88
N$9  (via drill 0.3)
  Top 0.152: v25.75,69.88 26,70.12 26,75.5 25.88,75.62 25.88,81.88 26.12,82.12 26.12,89.75 25.12,90.75 25.12,93.38 23,93.38 22.75,93.12 22.75,92.75 22.62,92.62 IC2.10
  Bottom 0.152: v25.75,69.88 25.38,69.5 10.38,69.5 7,66.12 2,66.12 LED7_G.1
N$10  (via drill 0.3)
  Top 0.152: v22,90.12 22,92.5 IC2.9 | v14.5,88.88 13,87.38 13,73.12 12.5,72.62 v12.5,72.12
  Bottom 0.152: v22,90.12 20.75,88.88 v14.5,88.88 | v12.5,72.12 9,68.62 2,68.62 LED7_R.1
N$11  (via drill 0.3)
  Top 0.152: v21.25,90.5 21.25,92.5 IC2.8 | v25.5,89.5 25.5,75.5 25.62,75.38 25.62,74.88 v25,74.25
  Bottom 0.152: v21.25,90.5 21.5,90.75 24.25,90.75 v25.5,89.5 | v25,74.25 24.5,74.75 11.12,74.75 10.38,74 3.38,74 2.5,74.88 1.5,74.88 0.75,74.12 0.75,71.12 LED6_G.1
N$12  (via drill 0.3)
  Top 0.152: v24,102.88 24,98.12 23.88,98 IC2.13 | v11.25,102 5,95.75 v5,84
  Bottom 0.152: v24,102.88 23.38,102.25 15.75,102.25 15.5,102 v11.25,102 | v5,84 4.88,83.88 2,83.88 LED4_R.1
N$13  (via drill 0.3)
  Top 0.152: v19,90.25 20.5,91.75 20.5,92.38 20.62,92.5 IC2.7 | v16.75,90.25 14,87.5 14,73.25 v13.5,72.75
  Bottom 0.152: v16.75,90.25 v19,90.25 | v13.5,72.75 2.88,72.75 2,73.62 LED6_R.1
N$14  (via drill 0.3)
  Top 0.152: v23.38,105.38 23.38,98.12 23.25,98 IC2.14 | v1.25,102.88 0.75,102.38 0.75,82.62 2,81.38 LED4_G.1
  Bottom 0.152: v23.38,105.38 23,105.75 5.38,105.75 2.5,102.88 v1.25,102.88
N$15  (via drill 0.3)
  Top 0.152: v15.25,76.5 15.25,87.38 19.88,92 19.88,92.38 20,92.5 IC2.6
  Bottom 0.152: v15.25,76.5 2.25,76.5 2,76.25 LED5_G.1
N$16
  Top 0.152: IC5.4 19.38,74.62 19.5,74.5 19.5,71.62 C29.2
N$17  (via drill 0.3)
  Top 0.152: v22.75,101.62 22.75,98.12 22.62,98 IC2.15 | v5.38,100.25 3.88,98.75 3.88,96.88 3.25,96.25 3.25,90.25 2,89 LED3_R.1
  Bottom 0.152: v22.75,101.62 22.62,101.5 16.62,101.5 15.38,100.25 v5.38,100.25
N$18  (via drill 0.3)
  Top 0.152: v22.38,108 22.12,107.75 22.12,98.12 22,98 IC2.16
  Bottom 0.152: v22.38,108 22.12,108.25 1.38,108.25 0.38,107.25 0.38,86.38 2,86.38 LED3_G.1
N$19  (via drill 0.3)
  Top 0.152: v21.62,93.5 21.5,93.62 21.5,97.75 21.38,97.88 IC2.17
  Bottom 0.152: v21.62,93.5 21.62,92.5 10.5,92.5 10.25,92.75 3.25,92.75 2,91.5 LED2_R.1
N$20  (via drill 0.3)
  Top 0.152: v20.88,93.88 20.88,97.75 20.75,97.88 IC2.18
  Bottom 0.152: v20.88,93.88 20.88,92.88 10.62,92.88 10.38,93.12 2.75,93.12 2,93.88 LED2_G.1
N$21  (via drill 0.3)
  Top 0.152: v20.12,93.5 20.12,97.88 IC2.19
  Bottom 0.152: v20.12,93.5 19.88,93.25 10.75,93.25 10.5,93.5 5,93.5 2,96.5 LED1_R.1
N$22  (via drill 0.3)
  Top 0.152: v14.62,79.38 14.62,87.25 19.25,91.88 19.25,92.5 IC2.5
  Bottom 0.152: v14.62,79.38 14.12,78.88 2.12,78.88 LED5_R.1
N$23  (via drill 0.3)
  Top 0.152: v19.38,93.88 19.38,97.88 IC2.20 | v3.25,97.75 2,99 LED1_G.1
  Bottom 0.152: v19.38,93.88 19.12,94.12 11.75,94.12 11.5,93.88 6.12,93.88 3.25,96.75 v3.25,97.75
N$27
  Top 0.152: 15.62,99.38 16.62,98.38 16.62,98.12 16.75,98 IC2.24 | 15.62,99.38 15.25,99.38 C8.1 15.62,99.38 | 15.5,103.88 12.75,103.88 L4.1 | 15.5,103.88 15.5,104.88 C7.+ | 15.62,99.38 16.12,99.88 16.12,103.25 15.5,103.88
N$28  (via drill 0.3)
  Top 0.152: v18.62,99.88 18.62,101.5 v17.25,102.88
  Bottom 0.152: 9.62,102.88 9.62,103.62 R14.1 | 9.62,102.88 9.62,101.25 R26.1 | v18.62,99.88 18.38,100.12 17.75,100.12 17.62,100.25 IC6.13 | v17.25,102.88 15,102.88 C39.1 14.88,103 12.5,103 R18.2 12.38,102.88 9.62,102.88
N$29  (via drill 0.3)
  Top 0.152: Q1.3 v11.5,54.62 11.5,55.62 11.75,55.88 C14.2 | v19.38,54.62 19.38,53.5 19.88,53 R5.2
  Bottom 0.152: v11.5,54.62 v19.38,54.62
N$30
  Bottom 0.152: IC7.6 23,82.5 22.88,82.38 22.5,82.38 22.25,82.12 22.25,80.88 25.38,80.88 C48.1 25.5,80.88 27.88,80.88 R34.2 28,80.88 30.38,80.88 R29.1 30.5,80.88 30.5,78.5 R38.1
N$31  (via drill 0.3)
  Top 0.152: v35.25,86.38 34.38,86.38 C56.1 | v9.12,94.5 10,93.62 v10,92.12
  Bottom 0.152: v35.25,86.38 38,86.38 TO_IC6C.1 38.12,86.38 39.38,86.38 39.38,89.38 38.62,90.12 36.25,90.12 34.25,92.12 v10,92.12 | v9.12,94.5 8.5,94.5 7.38,95.62 R41.2
N$32  (via drill 0.3)
  Top 0.152: v9.12,79.5 v9.12,77.38
  Bottom 0.152: v9.12,77.38 10.12,77.38 R39.1 | v9.12,79.5 10,80.38 10.12,80.38 R36.1 10.25,80.5 10.75,81 11.5,81 12.62,82.12 R35.2 12.75,82.12 15.12,82.12 C49.1 15.25,82.25 15.38,82.38 17.38,82.38 17.5,82.5 IC7.9
N$33
  Top 0.152: R10.1 4.5,43.25 2,43.25 JP5.2
N$34
  Bottom 0.152: C40.1 25.5,87.25 27.88,87.25 R19.2 28,87.12 28.12,87 30.38,87 R15.1 30.5,86.88 30.5,84.62 R23.1 30.38,84.62 24.88,84.62 24.62,84.88 23.25,84.88 23.12,85 IC7.2
N$35  (via drill 0.3)
  Top 0.152: C21.2 13.62,45.75 13.88,46 13.88,48.5 Q1.1 14,48.62 14,49.88 v14.25,50.12 | v19,49.88 19.88,50.75 R6.2
  Bottom 0.152: v19,49.88 18.75,50.12 v14.25,50.12
N$37
  Bottom 0.152: IC6.6 23.12,97.75 23.38,97.5 25.25,97.5 25.38,97.38 C46.1 25.5,97.38 27.88,97.38 R31.2 28,97.38 30.38,97.38 R30.1 30.5,97.38 33,97.38 R40.1
N$38
  Top 0.152: L3.2 18.38,9.75 18.38,7 D2.A
N$39
  Bottom 0.152: R41.1 9.88,97.38 R33.1 10,97.38 12.38,97.38 R32.2 12.5,97.38 14.88,97.38 C47.1 15.12,97.5 17.25,97.5 17.5,97.75 IC6.9
N$40  (via drill 0.3)
  Top 0.152: D1.C 35.62,7 35.62,9.38 L2.2 35.5,9.5 v24.88,9.5 | L5.2 9.62,17.75 14.62,17.75 14.62,14.25 L1.1 14.62,14.12 14.62,10.62 | 14.62,10.62 14.38,10.38 C2.1 14.62,10.62 | 14.62,10.62 v15.75,9.5
  Bottom 0.152: v15.75,9.5 v24.88,9.5
N$41
  Bottom 0.152: IC7.13 17.5,85.12 17.25,85.38 15.38,85.38 C41.1 15.12,85.5 12.75,85.5 R20.2 | R27.1 10.25,85.38 12.5,85.38 12.62,85.5 R20.2 | R13.1 10.25,88.12 10.25,86.62 11.88,86.62 12.62,85.88 12.62,85.62 R20.2
N$42
  Top 0.152: C13.1 10.25,15.25 10.25,15.5 8,17.75 L5.1 7.88,17.88 7.88,19.5 5.38,19.5 IC3.3
N$43  (via drill 0.3)
  Top 0.152: v11.62,86 12,85.62 v12,77.88 | v19.38,77.12 20.62,75.88 20.62,74.75 IC5.6
  Bottom 0.152: v11.62,86 11.38,86.25 8.12,86.25 5.5,88.88 R11.2 | v12,77.88 12.75,77.12 v19.38,77.12
N$46  (via drill 0.3)
  Top 0.152: v29.38,61.88 28.88,62.38 28.88,82.75 28,83.62 v28,89.38
  Bottom 0.152: v29.38,61.88 30.38,61.88 R21.2 | v28,89.38 25.88,91.5 7.25,91.5 C33.1 7.25,91.38 7.25,89 R11.1
N$47  (via drill 0.3)
  Top 0.152: v8.12,65.25 7.88,65.5 v7.88,81.5
  Bottom 0.152: v8.12,65.25 14.12,65.25 17.75,61.62 R16.2 | v7.88,81.5 7.88,82.5 7.25,82.5 R12.1 7.25,82.62 7.25,85 C35.1
N$48  (via drill 0.3)
  Top 0.152: v20.12,73.38 20.12,74.62 IC5.5 | v17.38,72.38 17.12,72.12 17.12,68.25 18,67.38 C31.1
  Bottom 0.152: v20.12,73.38 19.12,72.38 v17.38,72.38
N$51
  Top 0.152: R9.1 4.5,40.75 2,40.75 JP5.1
N$54  (via drill 0.3)
  Top 0.152: v20.5,81.5 20.5,82.12 21.5,82.12 23.12,83.75 C18.1 | v18.75,81.5 18.75,80.38 IC5.18
  Bottom 0.152: v18.75,81.5 v20.5,81.5
N$55  (via drill 0.3)
  Top 0.152: v19.38,78.5 21.25,76.62 21.25,74.75 IC5.7
  Bottom 0.152: v19.38,78.5 9.38,78.5 8.38,77.5 0.75,77.5 0.75,79.25 1.5,80 3,80 5.5,82.5 R12.2
N$56
  Top 0.152: D1.A 35.5,3.25 31.75,3.25 31.75,3.75 JP8.10 31.75,3.88 31.75,6.25 JP8.9
N$58
  Bottom 0.152: R28.2 11.5,57.62 13.88,57.62 C43.1 14,57.62 14.38,58 17.38,58 IC8.6 17.5,58.12 19.5,58.12 19.5,61.5 R16.1
N$60  (via drill 0.3)
  Top 0.152: v30.12,65.5 30,65.62 30,99 32.5,101.5 R47.2
  Bottom 0.152: R28.1 11.5,59.25 13.88,59.25 C43.2 14,59.25 14.5,58.75 17.38,58.75 IC8.7 17.5,58.75 18.62,58.75 18.62,62.12 19.75,63.25 27.88,63.25 v30.12,65.5
N$62
  Bottom 0.152: R21.1 30.38,60.12 28,60.12 R22.2 27.88,60.12 25.5,60.12 C42.1 25.38,60 24.25,58.88 23.38,58.88 IC8.2
N$63  (via drill 0.3)
  Top 0.152: v29.5,63.38 29.5,101.12 32.5,104.12 R46.2
  Bottom 0.152: v29.5,63.38 28,61.88 R22.1 27.88,61.88 25.5,61.88 C42.2 25.5,61.75 23.25,59.5 IC8.1
N$64
  Top 0.152: D2.C 18.38,3.25 21.5,3.25 21.5,3.75 JP8.2 21.62,3.88 21.62,6.25 JP8.1
N$65
  Top 0.152: R46.1 34.38,104.25 38,104.25 TO_IC8A.1
N$68
  Top 0.152: IC2.23 17.5,98 17.62,98.12 17.62,100.62 17.75,100.75 R3.1
N$69
  Top 0.152: R47.1 34.38,101.62 38,101.62 TO_IC8B.1
NORMALIZATION_PROBE  (via drill 0.3)
  Top 0.152: v33.25,50.88 33.25,50.62 32.25,50.62 IC4.30 | D3.3 38,51 36.38,51 36.38,56.75 38,58.38 TO_BAT.1
  Bottom 0.152: v33.25,50.88 34.5,52.12 35.62,52.12 38,54.5 38,58.38 TO_BAT.1
RESET  (via drill 0.3)
  Top 0.152: v22.25,50.62 23.62,50.62 IC4.7 | v16.75,56.5 16.75,51.12 v16.38,50.75 15.75,50.12 15.75,45.75 v15.5,45.5 | v21.75,56.62 22.75,56.62 C15.1 22.88,56.75 22.88,58.75 R4.2
  Bottom 0.152: v22.25,50.62 22.12,50.75 v16.38,50.75 | v16.75,56.5 16.88,56.62 v21.75,56.62 | v15.5,45.5 16.5,44.5 30.38,44.5 30.88,44 35.12,44 38,46.88 JP6.4
RX  (via drill 0.3)
  Top 0.152: v26.5,56.12 26.25,55.88 26.25,55.12 IC4.46 | v7.38,51.38 7.38,41.75 6.38,40.75 R9.2
  Bottom 0.152: v26.5,56.12 26.25,55.88 22.38,55.88 22.12,55.62 18.75,55.62 18.38,55.25 11.25,55.25 v7.38,51.38
SW_1  (via drill 0.3)
  Top 0.152: v26.75,60.88 26.75,57.12 27.62,56.25 27.62,55.12 IC4.43 | v38.88,72.38 39.75,73.25 39.75,106.75 v39.5,107
  Bottom 0.152: v26.75,60.88 26.88,61 31.12,61 34.5,64.38 34.5,70.25 35.5,70.25 37.62,72.38 v38.88,72.38 | v39.5,107 38.62,107.88 23.12,107.88 22.62,107.38 3,107.38 2.5,107.88 1.5,107.88 0.75,107.12 0.75,104.25 2,104.25 SW1.1
SW_2  (via drill 0.3)
  Top 0.152: v29,58.12 28.25,57.38 28.25,55.12 IC4.42 | v36.25,64 36.25,91.62 36.38,91.75 v36.38,101
  Bottom 0.152: v29,58.12 29.88,59 31.25,59 v36.25,64 | v36.38,101 33.75,103.62 23.38,103.62 23,103.25 17.75,103.25 15.62,105.38 5.75,105.38 2,101.62 SW2.1
SWCLK  (via drill 0.3)
  Top 0.152: v30.75,54 30.75,55 IC4.37 | v33.62,54 34.25,53.38 34.25,48.25 38,44.5 JP6.3
  Bottom 0.152: v33.62,54 v30.75,54
SWDIO
  Top 0.152: IC4.34 32.25,52.5 33.88,52.5 33.88,46.12 38,42 JP6.2
TIMBRE_ATT  (via drill 0.3)
  Top 0.152: v26.62,49.5 26.62,46.62 IC4.16 | v35.38,50.38 35.5,50.5 35.5,60.62 35.38,60.75 35.38,61.25 37.62,63.5 38,63.5 TIMBRE_ATT.1
  Bottom 0.152: v26.62,49.5 34.5,49.5 v35.38,50.38
TIMBRE_POT  (via drill 0.3)
  Top 0.152: v25.25,45.5 25.25,46.5 IC4.13 | v38.5,49.75 38.88,50.12 38.88,51.75 38.25,52.38 38.25,56.88 39.38,58 39.38,69 38.5,69.88 36.88,69.88 36.88,75 38,76.12 TIMBRE_POT.1
  Bottom 0.152: v25.25,45.5 26.12,46.38 35.12,46.38 v38.5,49.75
TX  (via drill 0.3)
  Top 0.152: v25.38,51.25 25.38,52.75 26.62,54 26.62,55 IC4.45 | v6.12,47.5 6.12,43.38 6.25,43.25 R10.2
  Bottom 0.152: v25.38,51.25 16.75,51.25 15.88,52.12 10.75,52.12 v6.12,47.5
V_OCT_IN  (via drill 0.3)
  Top 0.152: v36.88,77.88 36.88,92.75 38,93.88 TO_IC7B.1 | v35.38,93.88 34.38,93.88 C60.1
  Bottom 0.152: v36.88,77.88 32.62,77.88 32.12,78.38 R38.2 | v35.38,93.88 38,93.88 TO_IC7B.1
VCC  (via drill 0.3)
  Top 0.152: L2.1 35.5,11.12 32.12,11.12 32.12,11.38 C4.+ 32,11.5 32,12.25 v31.62,12.62
  Bottom 0.152: IC8.8 17.38,59.5 15.62,59.5 15.62,61.5 C37.1 15.5,61.62 14.75,62.38 5.12,62.38 2.38,59.62 1.5,59.62 0.75,58.88 0.75,30.88 13.38,30.88 v31.62,12.62
VEE  (via drill 0.3)
  Top 0.152: C5.- 21.25,11.5 18.5,11.5 L3.1 18.38,11.5 15.5,14.38 15.5,37 8.12,44.38 v8.12,55.88 | v21.62,67 21.88,66.75 v21.88,57.5
  Bottom 0.152: 23.38,57.38 23.25,57.38 IC8.4 | 23.38,57.38 24.75,57.38 25.38,56.75 C45.2 | v21.62,67 22.38,67 22.38,66.12 R37.1 | v21.88,57.5 23.12,57.5 IC8.4 | v8.12,55.88 18.5,55.88 18.62,56 22,56 23.38,57.38 | 23.38,57.38 IC8.4

## Text on the board
bNames: 2018 - V2.0 | CC-BY-SA 3.0 | Original design by Olivier Gillet